# Altium project Trigger Mainboard.PrjPcb
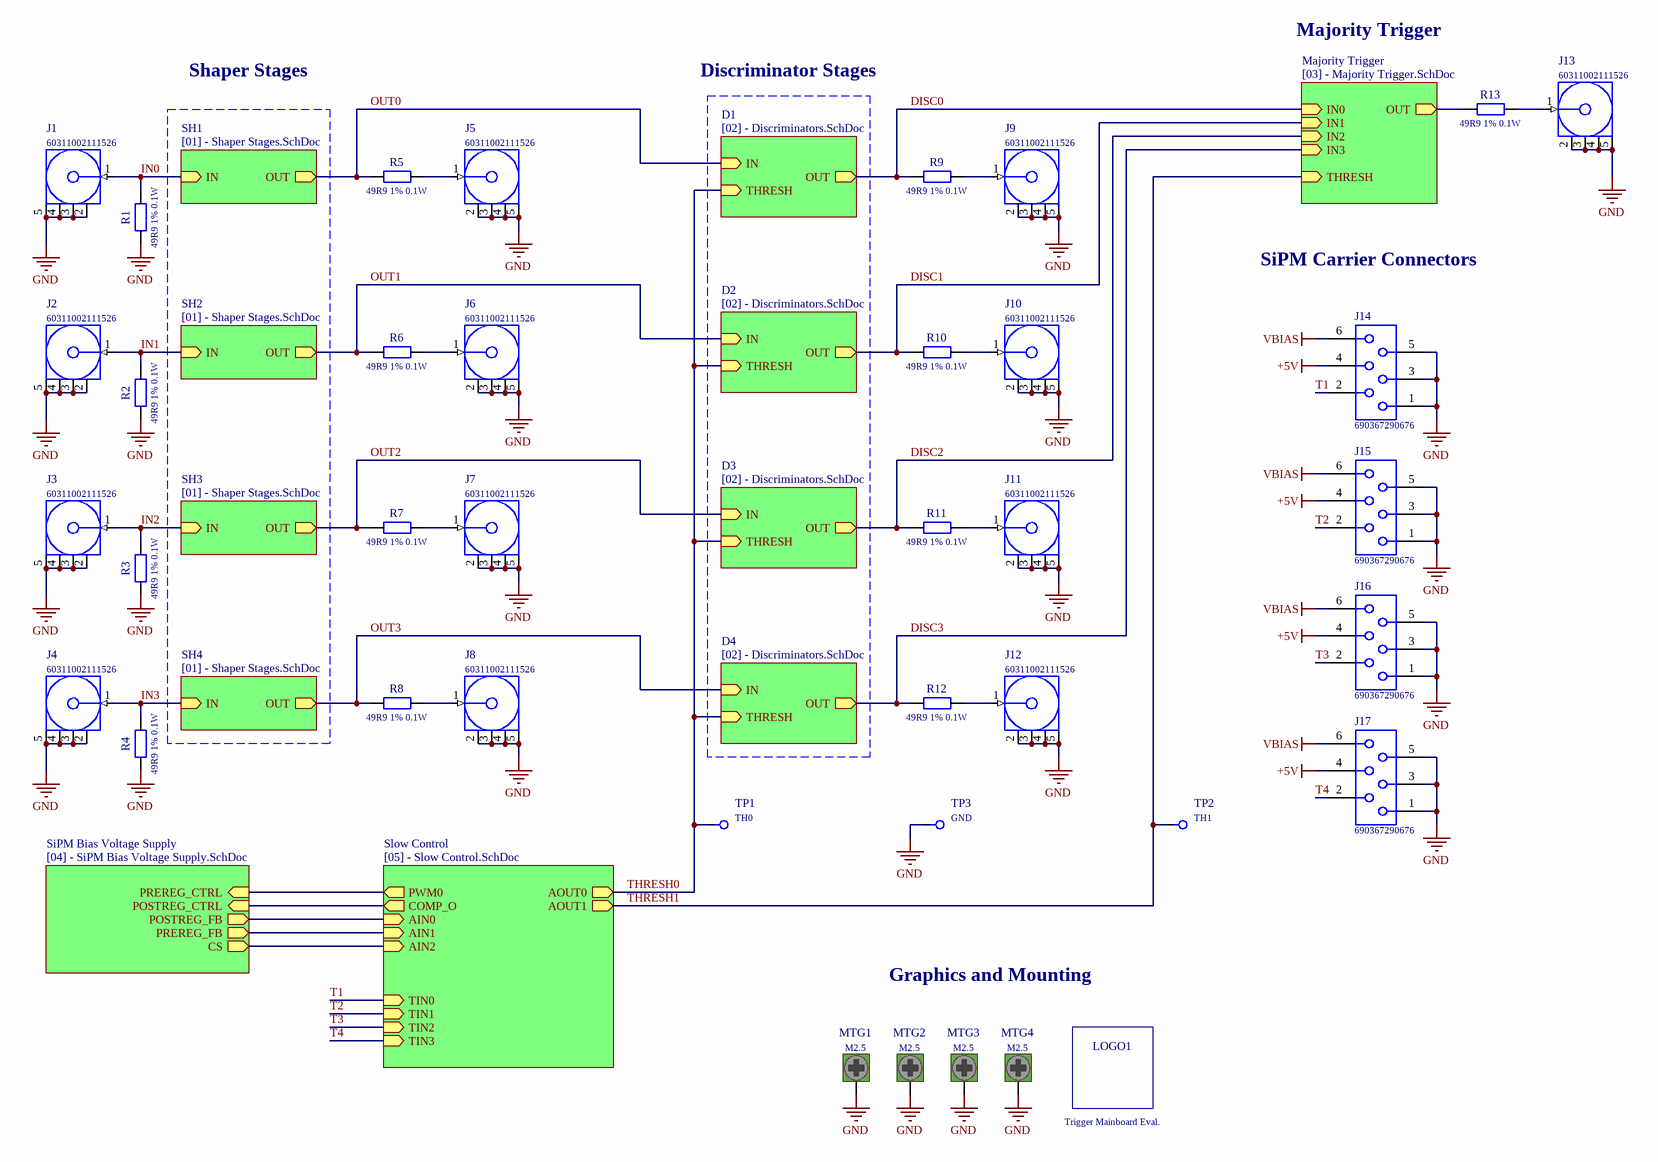
[diagram p0: [00] - Top Sheet.SchDoc]
My_Author: Name; My_Project_Heading: Title; My_Revision: 0
6 sheets, 252 parts. Net scope: hierarchical (ports join the sheet entries above them; power ports are global).
Board file: Trigger_Mainboard.PcbDoc
Sheets:
  [00] - Top Sheet.SchDoc
    Slow Control = [05] - Slow Control.SchDoc
    SH1 = [01] - Shaper Stages.SchDoc
    SH2 = [01] - Shaper Stages.SchDoc
    SH3 = [01] - Shaper Stages.SchDoc
    SH4 = [01] - Shaper Stages.SchDoc
    D1 = [02] - Discriminators.SchDoc
    Majority Trigger = [03] - Majority Trigger.SchDoc
    SiPM Bias Voltage Supply = [04] - SiPM Bias Voltage Supply.SchDoc
    D2 = [02] - Discriminators.SchDoc
    D3 = [02] - Discriminators.SchDoc
    D4 = [02] - Discriminators.SchDoc

## Sheet [00] - Top Sheet.SchDoc
size A3; Address1: III. Physikalisches Institut B; Address2: RWTH Aachen University; Address3: Otto-Blumenthal-Strasse; Address4: 52074 Aachen, GERMANY; DocumentNumber: 1; SheetNumber: 1; SheetTotal: 6

### Parts
J1  60311002111526  [60311002111526]
J2  60311002111526  [60311002111526]
J3  60311002111526  [60311002111526]
J4  60311002111526  [60311002111526]
J5  60311002111526  [60311002111526]
J6  60311002111526  [60311002111526]
J7  60311002111526  [60311002111526]
J8  60311002111526  [60311002111526]
J9  60311002111526  [60311002111526]
J10  60311002111526  [60311002111526]
J11  60311002111526  [60311002111526]
J12  60311002111526  [60311002111526]
J13  60311002111526  [60311002111526]
J14  690367290676  [690367290676]
J15  690367290676  [690367290676]
J16  690367290676  [690367290676]
J17  690367290676  [690367290676]
LOGO1  Trigger Mainboard Eval.  [RWTH_LOGO_4x15MM]  (no BOM)
MTG1  M2.5  [Mounting_Hole_M2.5]  (no BOM)
MTG2  M2.5  [Mounting_Hole_M2.5]  (no BOM)
MTG3  M2.5  [Mounting_Hole_M2.5]  (no BOM)
MTG4  M2.5  [Mounting_Hole_M2.5]  (no BOM)
R1  49R9 1% 0.1W  [0603_RES]
R2  49R9 1% 0.1W  [0603_RES]
R3  49R9 1% 0.1W  [0603_RES]
R4  49R9 1% 0.1W  [0603_RES]
R5  49R9 1% 0.1W  [0603_RES]
R6  49R9 1% 0.1W  [0603_RES]
R7  49R9 1% 0.1W  [0603_RES]
R8  49R9 1% 0.1W  [0603_RES]
R9  49R9 1% 0.1W  [0603_RES]
R10  49R9 1% 0.1W  [0603_RES]
R11  49R9 1% 0.1W  [0603_RES]
R12  49R9 1% 0.1W  [0603_RES]
R13  49R9 1% 0.1W  [0603_RES]
TP1  TH0  [Testpoint_5002]
TP2  TH1  [Testpoint_5002]
TP3  GND  [Testpoint_5001]

### Sub-sheets
D1 = [02] - Discriminators.SchDoc: IN (in), OUT (out), THRESH (in)
D2 = [02] - Discriminators.SchDoc: IN (in), OUT (out), THRESH (in)
D3 = [02] - Discriminators.SchDoc: IN (in), OUT (out), THRESH (in)
D4 = [02] - Discriminators.SchDoc: IN (in), OUT (out), THRESH (in)
Majority Trigger = [03] - Majority Trigger.SchDoc: IN0 (in), OUT (out), THRESH (in), IN2 (in), IN3 (in), IN1 (in)
SH1 = [01] - Shaper Stages.SchDoc: IN (in), OUT (out)
SH2 = [01] - Shaper Stages.SchDoc: IN (in), OUT (out)
SH3 = [01] - Shaper Stages.SchDoc: IN (in), OUT (out)
SH4 = [01] - Shaper Stages.SchDoc: IN (in), OUT (out)
SiPM Bias Voltage Supply = [04] - SiPM Bias Voltage Supply.SchDoc: PREREG_FB (out), CS (out), PREREG_CTRL (in), POSTREG_FB (out), POSTREG_CTRL (in)
Slow Control = [05] - Slow Control.SchDoc: TIN0 (in), TIN1 (in), TIN2 (in), TIN3 (in), PWM0 (out), AOUT0 (out), AOUT1 (out), AIN0 (in), AIN1 (in), COMP_O (out), AIN2 (in)

### Nets
+5V: J14.4 J15.4 J16.4 J17.4
GND: J1.2(GND) J1.3(GND) J1.4(GND) J1.5(GND) J2.2(GND) J2.3(GND) J2.4(GND) J2.5(GND) J3.2(GND) J3.3(GND) J3.4(GND) J3.5(GND) J4.2(GND) J4.3(GND) J4.4(GND) J4.5(GND) J5.2(GND) J5.3(GND) J5.4(GND) J5.5(GND) J6.2(GND) J6.3(GND) J6.4(GND) J6.5(GND) J7.2(GND) J7.3(GND) J7.4(GND) J7.5(GND) J8.2(GND) J8.3(GND) J8.4(GND) J8.5(GND) J9.2(GND) J9.3(GND) J9.4(GND) J9.5(GND) J10.2(GND) J10.3(GND) J10.4(GND) J10.5(GND) J11.2(GND) J11.3(GND) J11.4(GND) J11.5(GND) J12.2(GND) J12.3(GND) J12.4(GND) J12.5(GND) J13.2(GND) J13.3(GND) J13.4(GND) J13.5(GND) J14.1 J14.3 J14.5 J15.1 J15.3 J15.5 J16.1 J16.3 J16.5 J17.1 J17.3 J17.5 MTG1.1 MTG2.1 MTG3.1 MTG4.1 R1.2 R2.2 R3.2 R4.2 TP3.1
VBIAS: J14.6 J15.6 J16.6 J17.6
CSENSE: sheet Slow Control/AIN2, sheet SiPM Bias Voltage Supply/CS
DISC0: R9.2 ; sheet D1/OUT, sheet Majority Trigger/IN0
DISC1: R10.2 ; sheet Majority Trigger/IN1, sheet D2/OUT
DISC2: R11.2 ; sheet Majority Trigger/IN2, sheet D3/OUT
DISC3: R12.2 ; sheet Majority Trigger/IN3, sheet D4/OUT
IN0: J1.1(Signal) R1.1 ; sheet SH1/IN
IN1: J2.1(Signal) R2.1 ; sheet SH2/IN
IN2: J3.1(Signal) R3.1 ; sheet SH3/IN
IN3: J4.1(Signal) R4.1 ; sheet SH4/IN
OUT0: R5.2 ; sheet SH1/OUT, sheet D1/IN
OUT1: R6.2 ; sheet SH2/OUT, sheet D2/IN
OUT2: R7.2 ; sheet SH3/OUT, sheet D3/IN
OUT3: R8.2 ; sheet SH4/OUT, sheet D4/IN
POSTREG_CTRL: sheet Slow Control/COMP_O, sheet SiPM Bias Voltage Supply/POSTREG_CTRL
POSTREG_FB: sheet Slow Control/AIN1, sheet SiPM Bias Voltage Supply/PREREG_FB
PREREG_CTRL: sheet Slow Control/PWM0, sheet SiPM Bias Voltage Supply/PREREG_CTRL
PREREG_FB: sheet Slow Control/AIN0, sheet SiPM Bias Voltage Supply/POSTREG_FB
T1: J14.2 ; sheet Slow Control/TIN0
T2: J15.2 ; sheet Slow Control/TIN1
T3: J16.2 ; sheet Slow Control/TIN2
T4: J17.2 ; sheet Slow Control/TIN3
THRESH0: TP1.1 ; sheet Slow Control/AOUT0, sheet D1/THRESH, sheet D2/THRESH, sheet D3/THRESH, sheet D4/THRESH
THRESH1: TP2.1 ; sheet Slow Control/AOUT1, sheet Majority Trigger/THRESH
NetJ5_1: J5.1(Signal) R5.1
NetJ6_1: J6.1(Signal) R6.1
NetJ7_1: J7.1(Signal) R7.1
NetJ8_1: J8.1(Signal) R8.1
NetJ9_1: J9.1(Signal) R9.1
NetJ10_1: J10.1(Signal) R10.1
NetJ11_1: J11.1(Signal) R11.1
NetJ12_1: J12.1(Signal) R12.1
NetJ13_1: J13.1(Signal) R13.1
NetR13_2: R13.2 ; sheet Majority Trigger/OUT

### Notes on the sheet
- Majority Trigger
- Shaper Stages
- Discriminator Stages
- SiPM Carrier Connectors
- Graphics and Mounting
- TITLE
- REVISION
- PROJECT
- AUTHOR
- DESC.
- DATE
- SHEET
- OF

### Library data of the parts
J1-J13 = 60311002111526: WR-SMA PCB Jack, THT, Right Angle; Manufacturer: Wurth Elektronik; Impedance: 50Ohm; Frequency Range: DC~6GHz; Interface: MIL-STD-348; Center Contact Diameter: 1.27mm; ComponentLink1Description: Manufacturer; ComponentLink1URL: http://www.we-online.de; ComponentLink2Description: Datasheet; ComponentLink2URL: https://katalog.we-online.com/em/datasheet/60311002111526.pdf; PartNumber: 60311002111526; Published Date: May 2019; Operating Temperature: -65 to +165degC; Gender: Jack; Packaging: Tray; PackageReference: SMA; Mounting Technology: THT; Orientation Type: Right Angle
J14-J17 = 690367290676: WR-MM MiniModule Connector, Female, SMT, Vertical, pitch 2.54mm, 6pins; Manufacturer: Wurth Elektronik; Pin Number: 6; Insulation Resistance: >1000MOhm; Rated Current: 1.5A; Working Voltage: 100VAC; Withstanding Voltage: 500VAC; Contact Resistance: 10mOhm; ComponentLink1Description: Manufacturer; ComponentLink1URL: http://www.we-online.de; ComponentLink2Description: Datasheet; ComponentLink2URL: https://katalog.we-online.de/em/datasheet/690367290676.pdf; PartNumber: 690367290676; Published Date: June 2019; Pitch: 2.54mm; Operating Temperature: -40 to +105degC; Mounting Technology: SMT; Packaging: Tape and Reel; Gender: Female; Orientation: Vertical; PackageReference: WR-MM
LOGO1 = Logo: Logo Spaceholder.; Manufacturer: RWTH; Value: Trigger Mainboard Eval.
MTG1-MTG4 = Mounting_Hole: Simple mounting hole.; Value: M2.5
R1-R13 = Resistor: Simple generic resistor.; PackageReference: 0603; Value: 49R9 1% 0.1W
TP1-TP3 = Testpoint: Red PC Test Point, Miniature Phosphor Bronze, Silver Plating 0.040" (1.02mm) Hole Diameter Mounting Type.; Manufacturer: Keystone Electronics; PartNumber: 500X; PackageReference: Test Point
  TP1: Value: TH0
  TP2: Value: TH1
  TP3: Value: GND

## Sheet [05] - Slow Control.SchDoc
size A3; Address1: III. Physikalisches Institut B; Address2: RWTH Aachen University; Address3: Otto-Blumenthal-Strasse; Address4: 52074 Aachen, GERMANY; DocumentNumber: 6; SheetNumber: 6; SheetTotal: 6
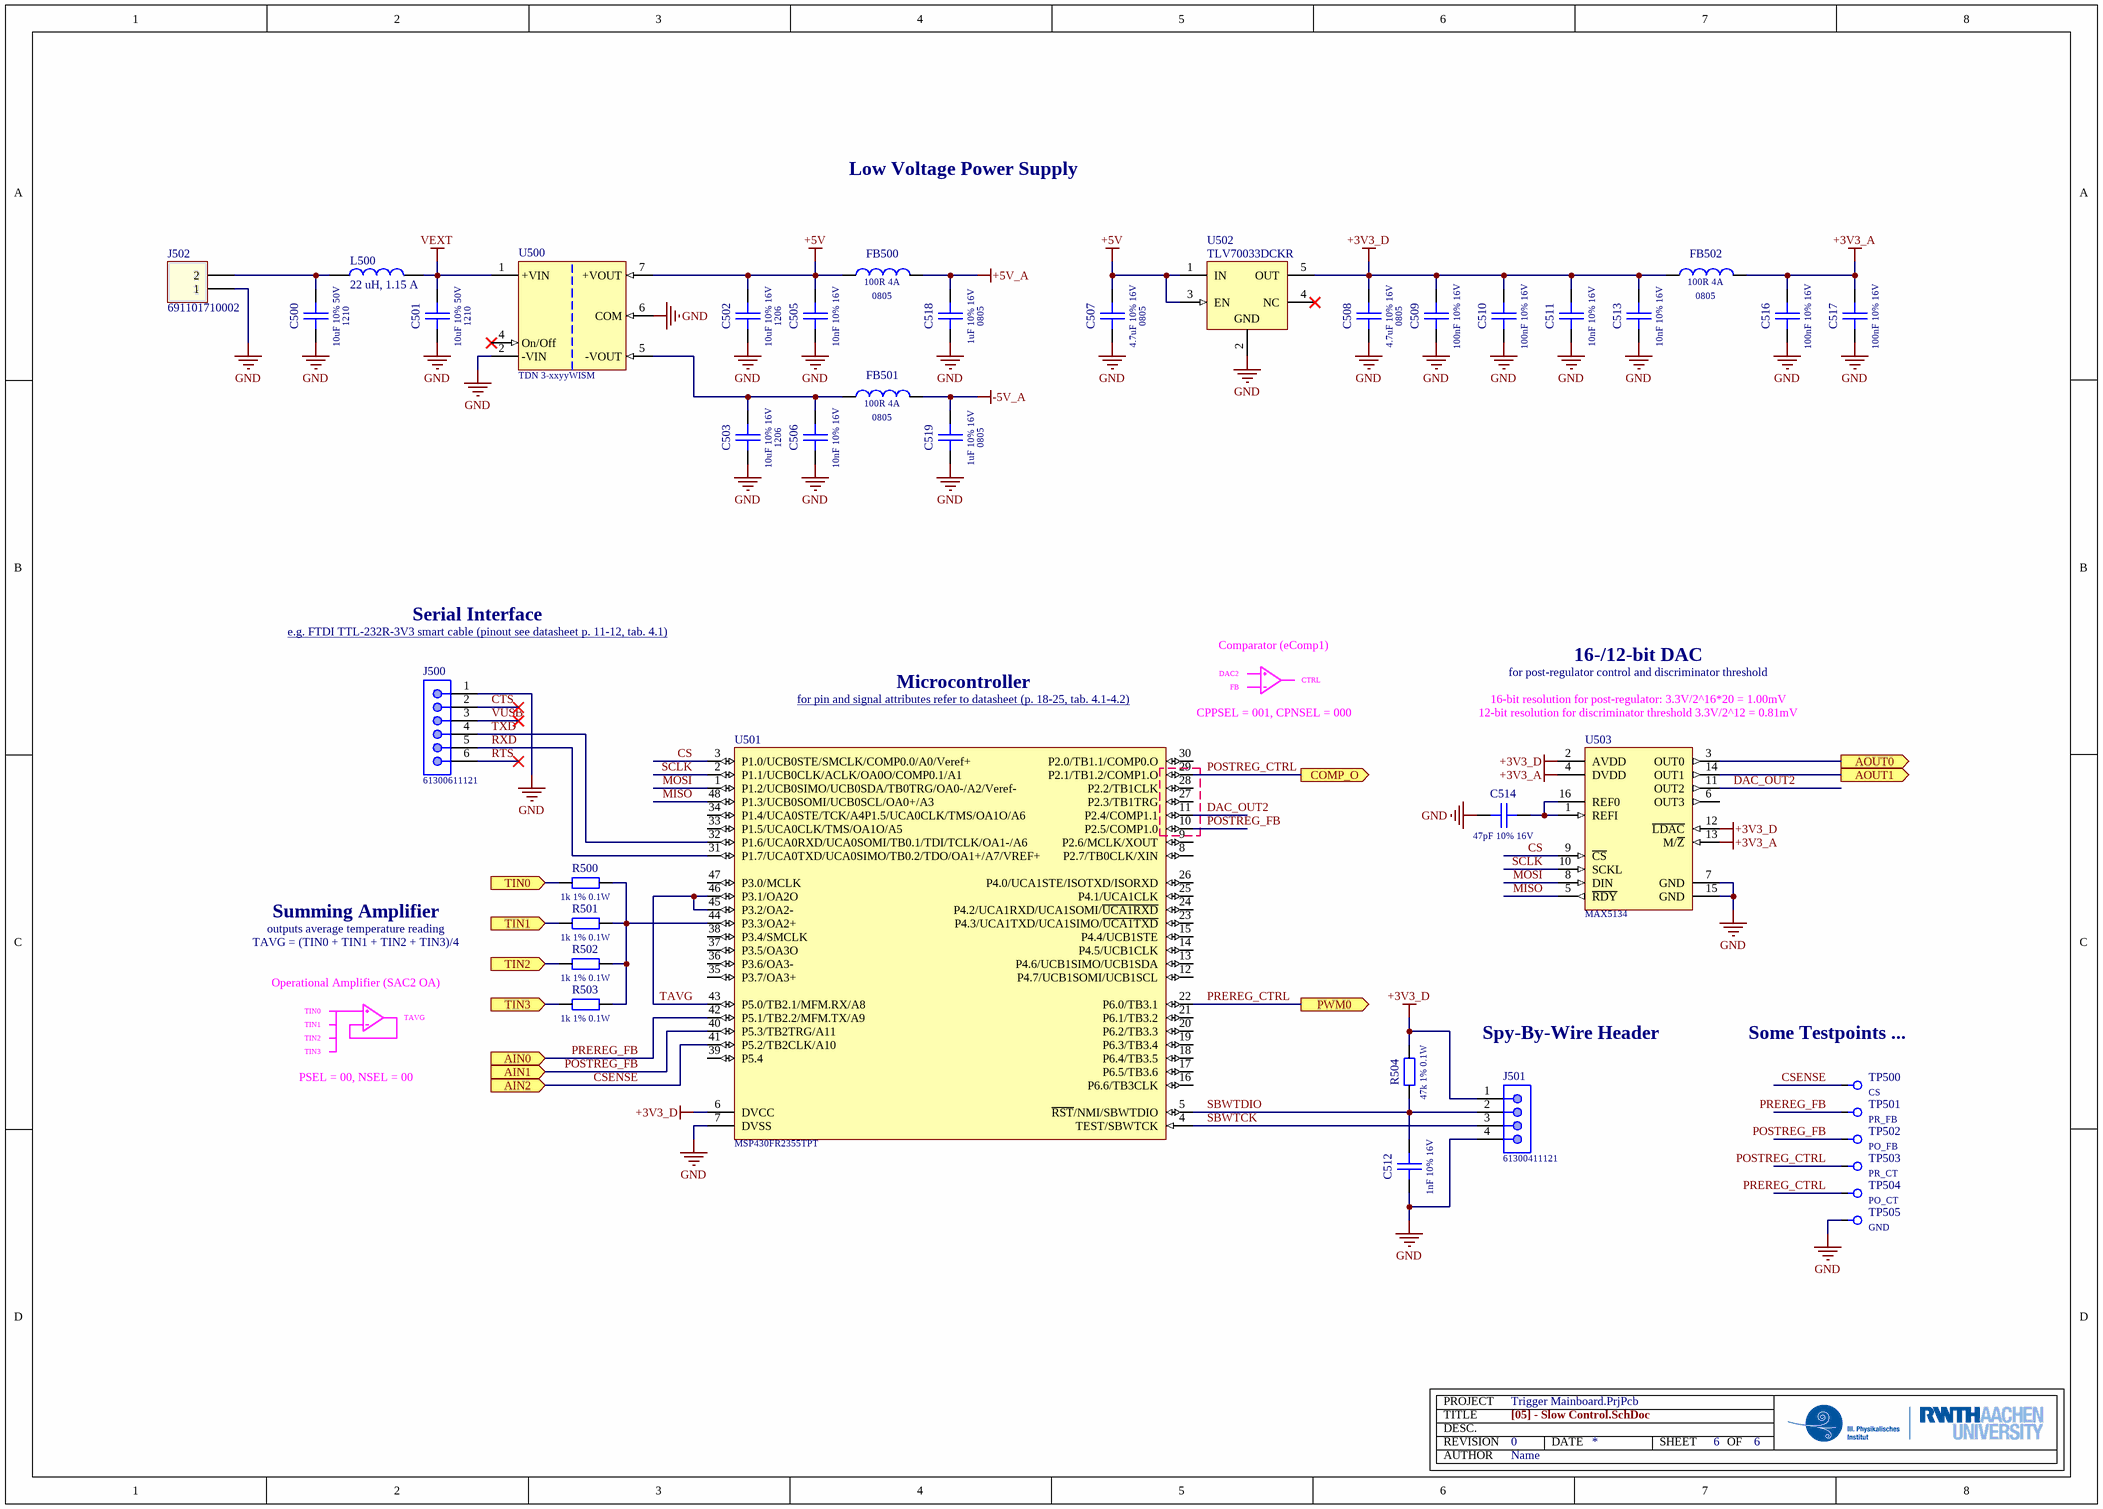
[diagram p1: [05] - Slow Control.SchDoc]

### Parts
C500  PackageReference: 1210  [1210_CAP]  (hidden comment: 10uF 10% 50V)
C501  PackageReference: 1210  [1210_CAP]  (hidden comment: 10uF 10% 50V)
C502  PackageReference: 1206  [1206_CAP]  (hidden comment: 10uF 10% 16V)
C503  PackageReference: 1206  [1206_CAP]  (hidden comment: 10uF 10% 16V)
C505  10nF 10% 16V  [0603_CAP]
C506  10nF 10% 16V  [0603_CAP]
C507  PackageReference: 0805  [0805_CAP]  (hidden comment: 4.7uF 10% 16V)
C508  PackageReference: 0805  [0805_CAP]  (hidden comment: 4.7uF 10% 16V)
C509  100nF 10% 16V  [0603_CAP]
C510  100nF 10% 16V  [0603_CAP]
C511  10nF 10% 16V  [0603_CAP]
C512  1nF 10% 16V  [0603_CAP]
C513  10nF 10% 16V  [0603_CAP]
C514  47pF 10% 16V  [0603_CAP]
C516  100nF 10% 16V  [0603_CAP]
C517  100nF 10% 16V  [0603_CAP]
C518  PackageReference: 0805  [0805_CAP]  (hidden comment: 1uF 10% 16V)
C519  PackageReference: 0805  [0805_CAP]  (hidden comment: 1uF 10% 16V)
FB500  PackageReference: 0805  [0805_RES]  (hidden comment: 100R 4A)
FB501  PackageReference: 0805  [0805_RES]  (hidden comment: 100R 4A)
FB502  PackageReference: 0805  [0603_RES]  (hidden comment: 100R 4A)
J500  61300611121  [61300611121]
J501  61300411121  [61300411121]
J502  691101710002  [691101710002]
L500  22 uH, 1.15 A  [WE-TPC_5828]
R500  1k 1% 0.1W  [0603_RES]
R501  1k 1% 0.1W  [0603_RES]
R502  1k 1% 0.1W  [0603_RES]
R503  1k 1% 0.1W  [0603_RES]
R504  47k 1% 0.1W  [0603_RES]
TP500  CS  [TESTPOINT_5019]
TP501  PR_FB  [TESTPOINT_5019]
TP502  PO_FB  [TESTPOINT_5019]
TP503  PR_CT  [TESTPOINT_5019]
TP504  PO_CT  [TESTPOINT_5019]
TP505  GND  [TESTPOINT_5019]
U500  TDN 3-xxyyWISM  [TDN_3WISM-PACK]
U501  MSP430FR2355TPT  [PQFP-48]
U502  TLV70033DCKR  [TI-DCK5_V]
U503  MAX5134  [TSSOP-16]

### Ports
AIN0 (in), AIN1 (in), AIN2 (in), AOUT0 (out), AOUT1 (out), COMP_O (out), PWM0 (out), TIN0 (in), TIN1 (in), TIN2 (in), TIN3 (in)

### Nets
+3V3_A: C516.2 C517.2 FB502.2 U503.4(DVDD) U503.13(M/~{Z})
+3V3_D: C508.2 C509.2 C510.2 C511.2 C513.2 FB502.1 J501.1 R504.1 U501.6(DVCC) U502.5(OUT) U503.2(AVDD) U503.12(~{LDAC})
+5V: C502.2 C505.2 C507.2 FB500.1 U500.7(+VOUT) U502.1(IN) U502.3(EN)
+5V_A: C518.2 FB500.2
-5V_A: C519.2 FB501.2
GND: C500.1 C501.1 C502.1 C503.1 C505.1 C506.1 C507.1 C508.1 C509.1 C510.1 C511.1 C512.1 C513.1 C514.1 C516.1 C517.1 C518.1 C519.1 J500.1 J501.4 J502.1 TP505.1 U500.2(-VIN) U500.6(COM) U501.7(DVSS) U502.2(GND) U503.7(GND) U503.15(GND)
VEXT: C501.2 L500.2 U500.1(+VIN)
~{CTS}: J500.2
CS: U501.3(P1.0/UCB0STE/SMCLK/COMP0.0/A0/Veref+) U503.9(~{CS})
CSENSE: TP500.1 U501.41(P5.2/TB2CLK/A10) ; port AIN2
DAC_OUT2: U501.11(P2.4/COMP1.1) U503.11(OUT2)
MISO: U501.48(P1.3/UCB0SOMI/UCB0SCL/OA0+/A3) U503.5(~{RDY})
MOSI: U501.1(P1.2/UCB0SIMO/UCB0SDA/TB0TRG/OA0-/A2/Veref-) U503.8(DIN)
POSTREG_CTRL: TP503.1 U501.29(P2.1/TB1.2/COMP1.O) ; port COMP_O
POSTREG_FB: TP502.1 U501.10(P2.5/COMP1.0) U501.40(P5.3/TB2TRG/A11) ; port AIN1
PREREG_CTRL: TP504.1 U501.22(P6.0/TB3.1) ; port PWM0
PREREG_FB: TP501.1 U501.42(P5.1/TB2.2/MFM.TX/A9) ; port AIN0
~{RTS}: J500.6
RXD: J500.5 U501.31(P1.7/UCA0TXD/UCA0SIMO/TB0.2/TDO/OA1+/A7/VREF+)
SBWTCK: J501.3 U501.4(TEST/SBWTCK)
SBWTDIO: C512.2 J501.2 R504.2 U501.5(~{RST}/NMI/SBWTDIO)
SCLK: U501.2(P1.1/UCB0CLK/ACLK/OA0O/COMP0.1/A1) U503.10(SCKL)
T1: R500.2 ; port TIN0
T2: R501.2 ; port TIN1
T3: R502.2 ; port TIN2
T4: R503.2 ; port TIN3
TAVG: U501.43(P5.0/TB2.1/MFM.RX/A8) U501.45(P3.2/OA2-) U501.46(P3.1/OA2O)
THRESH0: U503.3(OUT0) ; port AOUT0
THRESH1: U503.14(OUT1) ; port AOUT1
TXD: J500.4 U501.32(P1.6/UCA0RXD/UCA0SOMI/TB0.1/TDI/TCLK/OA1-/A6)
VUSB: J500.3
NetC500_2: C500.2 J502.2 L500.1
NetC503_2: C503.2 C506.2 FB501.1 U500.5(-VOUT)
NetC514_2: C514.2 U503.1(REFI) U503.16(REF0)
NetR500_1: R500.1 R501.1 R502.1 R503.1 U501.44(P3.3/OA2+)

Not connected (* = marked no-connect by the designer): U500 4(On/Off)*; U501 8(P2.7/TB0CLK/XIN) 9(P2.6/MCLK/XOUT) 12(P4.7/UCB1SOMI/UCB1SCL) 13(P4.6/UCB1SIMO/UCB1SDA) 14(P4.5/UCB1CLK) 15(P4.4/UCB1STE) 16(P6.6/TB3CLK) 17(P6.5/TB3.6) 18(P6.4/TB3.5) 19(P6.3/TB3.4) 20(P6.2/TB3.3) 21(P6.1/TB3.2) 23(P4.3/UCA1TXD/UCA1SIMO/~{UCA1TXD}) 24(P4.2/UCA1RXD/UCA1SOMI/~{UCA1RXD}) 25(P4.1/UCA1CLK) 26(P4.0/UCA1STE/ISOTXD/ISORXD) 27(P2.3/TB1TRG) 28(P2.2/TB1CLK) 30(P2.0/TB1.1/COMP0.O) 33(P1.5/UCA0CLK/TMS/OA1O/A5) 34(P1.4/UCA0STE/TCK/A4P1.5/UCA0CLK/TMS/OA1O/A6) 35(P3.7/OA3+) 36(P3.6/OA3-) 37(P3.5/OA3O) 38(P3.4/SMCLK) 39(P5.4) 47(P3.0/MCLK); U502 4(NC)*; U503 6(OUT3)

### Notes on the sheet
- Low Voltage Power Supply
- Serial Interface
- e.g. FTDI TTL-232R-3V3 smart cable (pinout see datasheet p. 11-12, tab. 4.1) <https://www.ftdichip.com/Support/Documents/DataSheets/Cables/DS_TTL-232R_CABLES.pdf>
- Comparator (eComp1)
- Microcontroller
- for pin and signal attributes refer to datasheet (p. 18-25, tab. 4.1-4.2) <https://www.ti.com/lit/ds/symlink/msp430fr2355.pdf?ts=1593776383476&ref_url=https%253A%252F%252Fwww.ti.com%252Fproduct%252FMSP430FR2355>
- DAC2
- FB
- (near U501) CPPSEL = 001, CPNSEL = 000
- CTRL
- 16-/12-bit DAC
- for post-regulator control and discriminator threshold
- 16-bit resolution for post-regulator: 3.3V/2^16*20 = 1.00mV
- (near U503) 12-bit resolution for discriminator threshold 3.3V/2^12 = 0.81mV
- Summing Amplifier
- outputs average temperature reading
- TAVG = (TIN0 + TIN1 + TIN2 + TIN3)/4
- Operational Amplifier (SAC2 OA)
- TIN0
- TIN1
- TIN2
- TIN3
- TAVG
- Spy-By-Wire Header
- (near TP500) Some Testpoints ...
- PSEL = 00, NSEL = 00
- TITLE
- REVISION
- PROJECT
- AUTHOR
- DESC.
- DATE
- SHEET
- OF

### Library data of the parts
C500-C503 C505-C514 C516-C519 = Capacitor: Simple generic capacitor.
  C500 C501: Value: 10uF 10% 50V
  C502 C503: Value: 10uF 10% 16V
  C505 C506 C511 C513: PackageReference: 0603; Value: 10nF 10% 16V
  C507 C508: Value: 4.7uF 10% 16V
  C509 C510 C516 C517: PackageReference: 0603; Value: 100nF 10% 16V
  C512: PackageReference: 0603; Value: 1nF 10% 16V
  C514: PackageReference: 0603; Value: 47pF 10% 16V
  C518 C519: Value: 1uF 10% 16V
FB500-FB502 = Inductor: Simple generic inductor.; Manufacturer: TDK; PartNumber: MPZ2012S101ATD25; Value: 100R 4A
J500 = 61300611121: WR-PHD Pin Header, THT, pitch 2.54mm, Single Row, Vertical, 6pin; Pin Number: 6; Gender: Male; Rated Current: 3A; Working Voltage: 250VAC; Withstanding Voltage: 500VAC; Contact Resistance: 20mOhm; ComponentLink1Description: Manufacturer; ComponentLink1URL: http://www.we-online.de; ComponentLink2Description: Datasheet; ComponentLink2URL: https://katalog.we-online.de/em/datasheet/6130xx11121.pdf; Part Number: 61300611121; Published Date: June 2019; Publisher: Wurth Elektronik; Pitch: 2.54mm; Operating Temperature: -40 to +105degC; Mounting Technology: THT; Packaging: Bag; Row Number: Single; Orientation: Vertical
J501 = 61300411121: WR-PHD Pin Header, THT, pitch 2.54mm, Single Row, Vertical, 4pin; Pin Number: 4; Gender: Male; Rated Current: 3A; Working Voltage: 250VAC; Withstanding Voltage: 500VAC; Contact Resistance: 20mOhm; ComponentLink1Description: Manufacturer; ComponentLink1URL: http://www.we-online.de; ComponentLink2Description: Datasheet; ComponentLink2URL: https://katalog.we-online.de/em/datasheet/6130xx11121.pdf; Part Number: 61300411121; Published Date: June 2019; Publisher: Wurth Elektronik; Pitch: 2.54mm; Operating Temperature: -40 to +105degC; Mounting Technology: THT; Packaging: Bag; Row Number: Single; Orientation: Vertical
J502 = 691101710002: WR-TBL Serie 101 - 5.00 mm Horizontal Entry Modular, 02p; Pitch: 5 mm; ComponentLink1Description: Manufacturer; ComponentLink1URL: http://www.we-online.de; ComponentLink2Description: Datasheet; ComponentLink2URL: http://katalog.we-online.de/em/datasheet/6911017100xx.pdf; Part Number: 691101710002; Published Date: Feb. 2017; Publisher: Wurth Elektronik; Pin Number: 02p
L500 = 744053220: SMT Shielded Tiny Power Inductor WE-TPC, size 5828, 22 uH, 1.15 A; Rated Current: 1.15 A; Inductance: 22 uH; DC Resistance max.: 120 mOhm; Self Resonant Frequency: 20 MHz; Saturation Current: 0.9 A; ComponentLink1Description: Manufacturer; ComponentLink1URL: http://www.we-online.de; ComponentLink2Description: Datasheet; ComponentLink2URL: https://katalog.we-online.com/pbs/datasheet/744053220.pdf; Part Number: 744053220; Published Date: December 2018; Publisher: Wurth Elektronik; PackageReference: 5828; Operating Temperature: -40 to +125 degC; Mounting Technology: SMT; Packaging: Tape and Reel
R500-R504 = Resistor: Simple generic resistor.; PackageReference: 0603
  R500-R503: Value: 1k 1% 0.1W
  R504: Value: 47k 1% 0.1W
TP500-TP505 = Testpoint: as TP1 on sheet [00] - Top Sheet; PackageReference: Test Point
  TP500: Value: CS
  TP501: Value: PR_FB
  TP502: Value: PO_FB
  TP503: Value: PR_CT
  TP504: Value: PO_CT
  TP505: Value: GND
U500 = _BLANK_1: TDN 3WISM Series, 3 Watt DC/DC converter.; Manufacturer: Traco Power; PackageReference: TDN-3-Pack; Value: TDN 3-xxyyWISM
U501 = MSP430FR2355TPT: Mixed-Signal Microcontroller.; Manufacturer: Texas Instruments; PackageReference: LQFP-48; PartNumber: MSP430FR2355TPT; Supplier1: Mouser; Supplier1Link: https://www.mouser.de/ProductDetail/Texas-Instruments/MSP430FR2355TPT?qs=sGAEpiMZZMsp%252Bcahb6g%252BW1GHiEy7RoiAFs9DV1sKylCWNRvNatvbuQ%3D%3D; Supplier1PartNumber: 595-MSP430FR2355TPT; Value: MSP430FR2355TPT
U502 = TLV70033DCKR: Single Output LDO, 200 mA, Fixed 3.3 V Output, 2 to 5.5 V Input, with Low IQ, 5-pin SC70 (DCK), -40 to 125 degC, Green (RoHS & no Sb/Br); Manufacturer: Texas Instruments; Accuracy(%): 2; Fixed Output Options(V): 3.3; Iout(Max)(A): 0.2; Iq(Typ)(mA): 0.03; SubFamily: Single Channel LDO; Vdo(Typ)(mV): 175; Vin(Max)(V): 5.5; DatasheetVersion: SLVSA00D; PackageVersion: 4093553-3/G; PackageReference: DCK5; PackageDescription: 5-Pin Plastic Small-Outline, Body 2 x 1.25 mm, Pitch 0.65 mm; Supplier 1: Digi-Key; Supplier Part Number 1: 296-32413-2-ND; Supplier 2: Digi-Key; Supplier Part Number 2: 296-32413-1-ND; Supplier 3: Digi-Key; Supplier Part Number 3: 296-32413-6-ND; Supplier 4: Newark; Supplier Part Number 4: 55R7467; Supplier 5: Mouser; Supplier Part Number 5: 595-TLV70033DCKR; Eco-Plan: Green (RoHS & no Sb/Br); Vin(Min)(V): 2; Vout Adj(Max)(V): 3.3; Vout Adj(Min)(V): 3.3; Mounting Technology: Surface Mount; Code_JEDEC: MO-203; PartNumber: TLV70033DCKR; ComponentLink1Description: Manufacturer URL; ComponentLink1URL: http://www.ti.com/; ComponentLink2Description: Datasheet; ComponentLink2URL: http://www.ti.com/general/docs/lit/getliterature.tsp?genericPartNumber=TLV70033&fileType=pdf; ComponentLink3Description: Package Specification; ComponentLink3URL: http://www.ti.com/litv/pdf/mpds025f
U503 = MAX5134: Pin-/Software-Compatible, 16-/12-Bit, Voltage-Output DACs.; Manufacturer: Maxim Integrated; PartNumber: MAX5134AGUE+; PackageReference: TSSOP-16; Supplier1: RS-Components; Supplier1PartNumber: 190-5093; Supplier1Link: https://de.rs-online.com/web/p/d-a-wandler/1905093/; ComponentLink1Description: New link; ComponentLink1URL: *; Value: MAX5134

## Sheet [01] - Shaper Stages.SchDoc
size A4; Address1: III. Physikalisches Institut B; Address2: RWTH Aachen University; Address3: Otto-Blumenthal-Strasse; Address4: 52074 Aachen, GERMANY; DocumentNumber: 2; SheetNumber: 2; SheetTotal: 6
Used 4 times, as channels SH1, SH2, SH3, SH4. Parts and nets are listed once, with the designators drawn on the sheet.
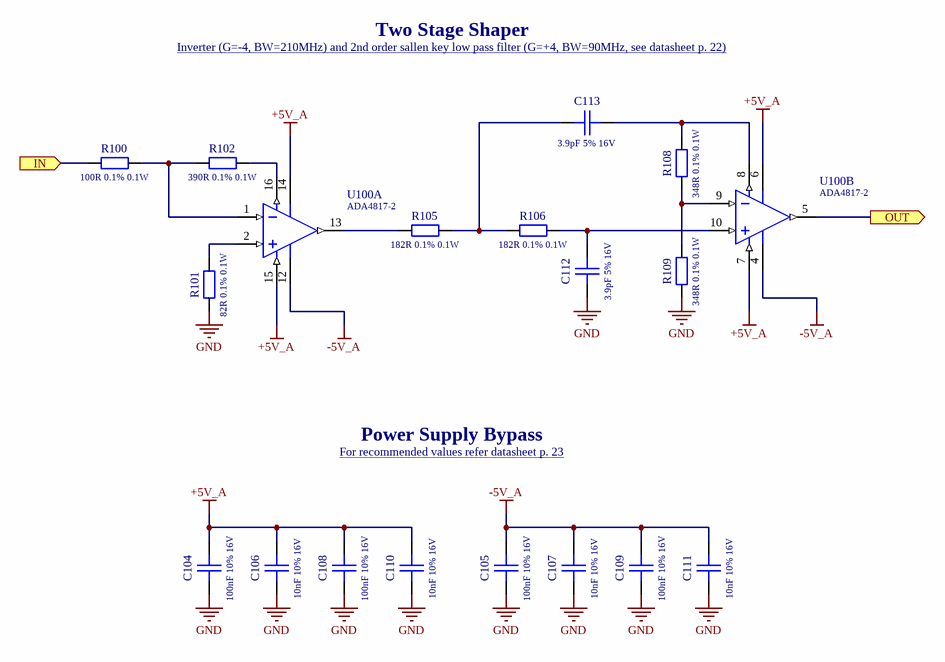
[diagram p2: [01] - Shaper Stages.SchDoc]

### Parts
C104  100nF 10% 16V  [0603_CAP]
C105  100nF 10% 16V  [0603_CAP]
C106  10nF 10% 16V  [0603_CAP]
C107  10nF 10% 16V  [0603_CAP]
C108  100nF 10% 16V  [0603_CAP]
C109  100nF 10% 16V  [0603_CAP]
C110  10nF 10% 16V  [0603_CAP]
C111  10nF 10% 16V  [0603_CAP]
C112  3.9pF 5% 16V  [0603_CAP]
C113  3.9pF 5% 16V  [0603_CAP]
R100  100R 0.1% 0.1W  [0603_RES]
R101  82R 0.1% 0.1W  [0603_RES]
R102  390R 0.1% 0.1W  [0603_RES]
R105  182R 0.1% 0.1W  [0603_RES]
R106  182R 0.1% 0.1W  [0603_RES]
R108  348R 0.1% 0.1W  [0603_RES]
R109  348R 0.1% 0.1W  [0603_RES]
U100  ADA4817-2  [LFCSP-16]  (parts A,B of 2)

### Ports
IN (in), OUT (out)

### Nets
+5V_A: C104.2 C106.2 C108.2 C110.2 U100.6(#VS2) U100.7(~{PD2}) U100.14(VS+) U100.15(~{PD})
-5V_A: C105.2 C107.2 C109.2 C111.2 U100.4(-VS2) U100.12(-VS1)
GND: C104.1 C105.1 C106.1 C107.1 C108.1 C109.1 C110.1 C111.1 C112.1 R101.2 R109.2
IN: R100.2 ; port IN
OUT: U100.5(OUT2) ; port OUT
NetC112_2: C112.2 R106.1 U100.10(IN2+)
NetC113_1: C113.1 R105.1 R106.2
NetC113_2: C113.2 R108.1 U100.8(FB2)
NetR100_1: R100.1 R102.2 U100.1(IN1-)
NetR101_1: R101.1 U100.2(IN2+)
NetR102_1: R102.1 U100.16(FB1)
NetR105_2: R105.2 U100.13(OUT1)
NetR108_2: R108.2 R109.1 U100.9(IN2-)

### Channels
SH1: designators end in A; ports IN=IN0 OUT=OUT0
SH2: designators end in B; ports IN=IN1 OUT=OUT1
SH3: designators end in C; ports IN=IN2 OUT=OUT2
SH4: designators end in D; ports IN=IN3 OUT=OUT3

### Notes on the sheet
- Two Stage Shaper
- Inverter (G=-4, BW=210MHz) and 2nd order sallen key low pass filter (G=+4, BW=90MHz, see datasheet p. 22) <https://www.analog.com/media/en/technical-documentation/data-sheets/ADA4817-1_4817-2.pdf>
- Power Supply Bypass
- For recommended values refer datasheet p. 23 <https://www.analog.com/media/en/technical-documentation/data-sheets/ADA4817-1_4817-2.pdf>
- TITLE
- REVISION
- PROJECT
- AUTHOR
- DESC.
- DATE
- SHEET
- OF

### Library data of the parts
C104-C113 = Capacitor: Simple generic capacitor.; PackageReference: 0603
  C104 C105 C108 C109: Value: 100nF 10% 16V
  C106 C107 C110 C111: Value: 10nF 10% 16V
  C112 C113: Value: 3.9pF 5% 16V
R100-R102 R105 R106 R108 R109 = Resistor: Simple generic resistor.; PackageReference: 0603
  R100: Value: 100R 0.1% 0.1W
  R101: Value: 82R 0.1% 0.1W
  R102: Value: 390R 0.1% 0.1W
  R105 R106: Value: 182R 0.1% 0.1W
  R108 R109: Value: 348R 0.1% 0.1W
U100 = ADA4817-2: Low Noise, 1 GHz FastFET Op Amps; Manufacturer: Analog Devices; PartNumber: LMV358QDGKR; PackageReference: LFCSP-16; Supplier1: RS-Components; Supplier1PartNumber: 764-8781; Supplier1Link: https://de.rs-online.com/web/p/operationsverstarker/7648781/; Value: ADA4817-2

## Sheet [02] - Discriminators.SchDoc
size A4; Address1: III. Physikalisches Institut B; Address2: RWTH Aachen University; Address3: Otto-Blumenthal-Strasse; Address4: 52074 Aachen, GERMANY; DocumentNumber: 3; SheetNumber: 3; SheetTotal: 6
Used 4 times, as channels D1, D2, D3, D4. Parts and nets are listed once, with the designators drawn on the sheet.
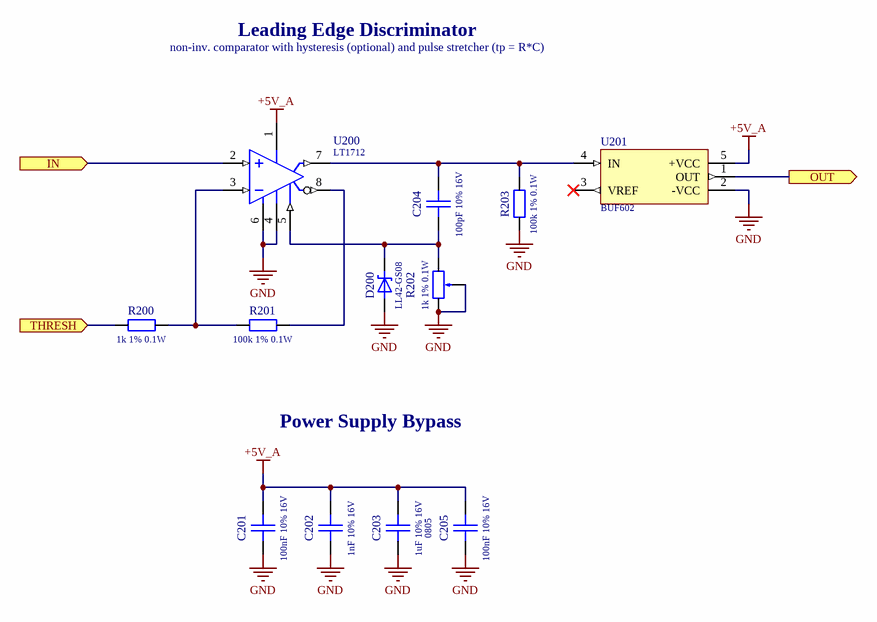
[diagram p3: [02] - Discriminators.SchDoc]

### Parts
C201  100nF 10% 16V  [0603_CAP]
C202  1nF 10% 16V  [0603_CAP]
C203  PackageReference: 0805  [0805_CAP]  (hidden comment: 1uF 10% 16V)
C204  100pF 10% 16V  [0603_CAP]
C205  100nF 10% 16V  [0603_CAP]
D200  LL42-GS08  [MiniMELF]
R200  1k 1% 0.1W  [0603_RES]
R201  100k 1% 0.1W  [0603_RES]
R202  1k 1% 0.1W  [3224W]
R203  100k 1% 0.1W  [0603_RES]
U200  LT1712  [MSOP-8]
U201  BUF602  [SOT-23-5]

### Ports
IN (in), OUT (out), THRESH (in)

### Nets
+5V_A: C201.2 C202.2 C203.2 C205.2 U200.1(+V) U201.5(+VCC)
GND: C201.1 C202.1 C203.1 C205.1 D200.2(A) R202.1(CCW) R202.2(WIPER) R203.2 U200.4(-V) U200.6(GND) U201.2(-VCC)
IN: U200.2(+IN) ; port IN
OUT: U201.1(OUT) ; port OUT
THRESH: R200.2 ; port THRESH
NetC204_1: C204.1 D200.1(K) R202.3(CW) U200.5(LE)
NetC204_2: C204.2 R203.1 U200.7(Q) U201.4(IN)
NetR200_1: R200.1 R201.2 U200.3(-IN)
NetR201_1: R201.1 U200.8(~{Q})

Not connected (* = marked no-connect by the designer): U201 3(VREF)*

### Channels
D1: designators end in A; ports IN=OUT0 OUT=DISC0 THRESH=THRESH0
D2: designators end in B; ports IN=OUT1 OUT=DISC1 THRESH=THRESH0
D3: designators end in C; ports IN=OUT2 OUT=DISC2 THRESH=THRESH0
D4: designators end in D; ports IN=OUT3 OUT=DISC3 THRESH=THRESH0

### Notes on the sheet
- Leading Edge Discriminator
- non-inv. comparator with hysteresis (optional) and pulse stretcher (tp = R*C)
- Power Supply Bypass
- TITLE
- REVISION
- PROJECT
- AUTHOR
- DESC.
- DATE
- SHEET
- OF

### Library data of the parts
C201-C205 = Capacitor: Simple generic capacitor.
  C201 C205: PackageReference: 0603; Value: 100nF 10% 16V
  C202: PackageReference: 0603; Value: 1nF 10% 16V
  C203: Value: 1uF 10% 16V
  C204: PackageReference: 0603; Value: 100pF 10% 16V
D200 = Schottky Diode: Simple schottky diode.; Manufacturer: Vishay; PackageReference: MiniMELF; PartNumber: LL42-GS08; Value: LL42-GS08
R200 R201 R203 = Resistor: Simple generic resistor.; PackageReference: 0603
  R200: Value: 1k 1% 0.1W
  R201 R203: Value: 100k 1% 0.1W
R202 = Potentiometer: Simple generic potentiometer.; Value: 1k 1% 0.1W
U200 = LT1712: Single/Dual 4.5ns, 3V/5V/±5V, Rail-to-Rail Comparators; Manufacturer: Analog Devices; PartNumber: LT1712CGN; PackageReference: SSOP-16; Supplier1: Digi-Key; Supplier1PartNumber: LT1712CGN#PBF-ND; Supplier1Link: https://www.digikey.de/product-detail/de/linear-technology-analog-devices/LT1712CGN-PBF/LT1712CGN-PBF-ND/961051; Value: LT1712
U201 = BUF602: High-Speed, Closed-Loop Buffer.; Manufacturer: Texas Instruments; PartNumber: BUF602IDBVT; PackageReference: SOT-23-5; Value: BUF602

## Sheet [03] - Majority Trigger.SchDoc
size A4; Address1: III. Physikalisches Institut B; Address2: RWTH Aachen University; Address3: Otto-Blumenthal-Strasse; Address4: 52074 Aachen, GERMANY; DocumentNumber: 4; SheetNumber: 4; SheetTotal: 6
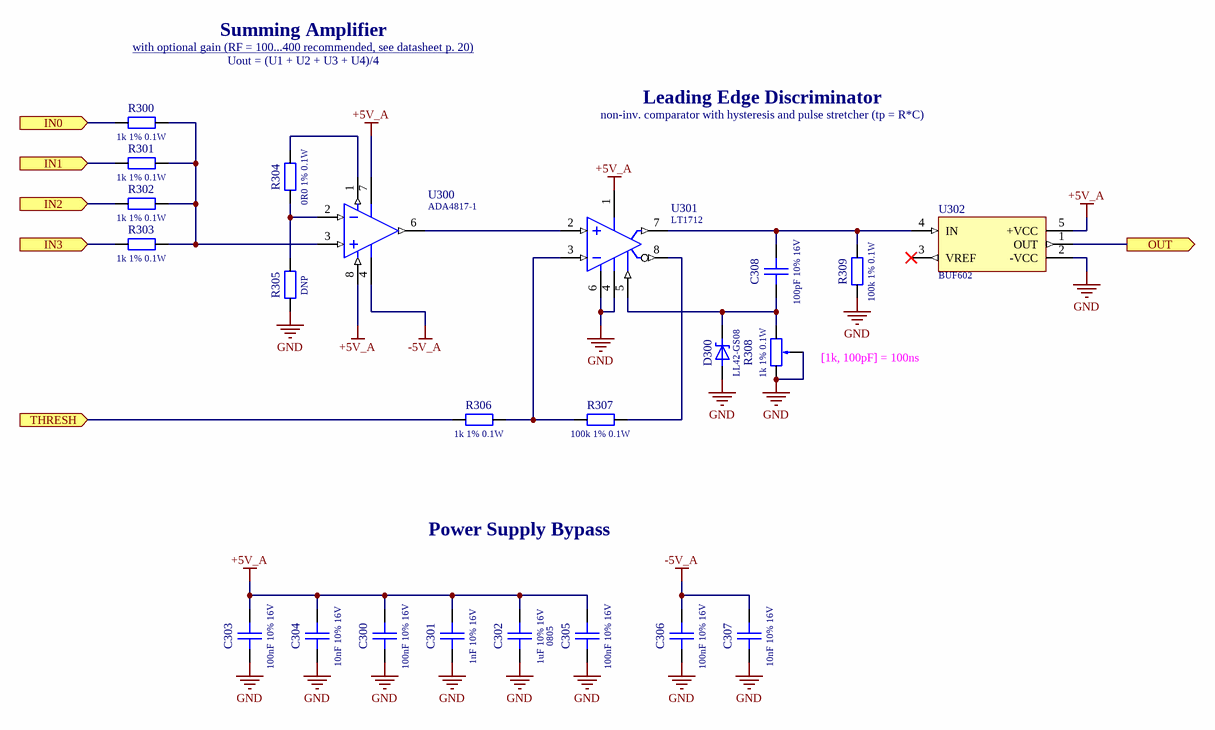
[diagram p4: [03] - Majority Trigger.SchDoc]

### Parts
C300  100nF 10% 16V  [0603_CAP]
C301  1nF 10% 16V  [0603_CAP]
C302  PackageReference: 0805  [0805_CAP]  (hidden comment: 1uF 10% 16V)
C303  100nF 10% 16V  [0603_CAP]
C304  10nF 10% 16V  [0603_CAP]
C305  100nF 10% 16V  [0603_CAP]
C306  100nF 10% 16V  [0603_CAP]
C307  10nF 10% 16V  [0603_CAP]
C308  100pF 10% 16V  [0603_CAP]
D300  LL42-GS08  [MiniMELF]
R300  1k 1% 0.1W  [0603_RES]
R301  1k 1% 0.1W  [0603_RES]
R302  1k 1% 0.1W  [0603_RES]
R303  1k 1% 0.1W  [0603_RES]
R304  0R0 1% 0.1W  [0603_RES]
R305  DNP  [0603_RES]
R306  1k 1% 0.1W  [0603_RES]
R307  100k 1% 0.1W  [0603_RES]
R308  1k 1% 0.1W  [3224W]
R309  100k 1% 0.1W  [0603_RES]
U300  ADA4817-1  [SOIC_8]
U301  LT1712  [MSOP-8]
U302  BUF602  [SOT-23-5]

### Ports
IN0 (in), IN1 (in), IN2 (in), IN3 (in), OUT (out), THRESH (in)

### Nets
+5V_A: C300.2 C301.2 C302.2 C303.2 C304.2 C305.2 U300.7(+VS) U300.8(~{PD}) U301.1(+V) U302.5(+VCC)
-5V_A: C306.2 C307.2 U300.4(-VS)
GND: C300.1 C301.1 C302.1 C303.1 C304.1 C305.1 C306.1 C307.1 D300.2(A) R305.2 R308.1(CCW) R308.2(WIPER) R309.2 U301.4(-V) U301.6(GND) U302.2(-VCC)
DISC0: R300.2 ; port IN0
DISC1: R301.2 ; port IN1
DISC2: R302.2 ; port IN2
DISC3: R303.2 ; port IN3
THRESH1: R306.2 ; port THRESH
NetC308_1: C308.1 D300.1(K) R308.3(CW) U301.5(LE)
NetC308_2: C308.2 R309.1 U301.7(Q) U302.4(IN)
NetR13_2: U302.1(OUT) ; port OUT
NetR300_1: R300.1 R301.1 R302.1 R303.1 U300.3(IN+)
NetR304_1: R304.1 U300.1(FB)
NetR304_2: R304.2 R305.1 U300.2(IN-)
NetR306_1: R306.1 R307.2 U301.3(-IN)
NetR307_1: R307.1 U301.8(~{Q})
NetU300_6: U300.6(OUT) U301.2(+IN)

Not connected (* = marked no-connect by the designer): U302 3(VREF)*

### Notes on the sheet
- Summing Amplifier
- with optional gain (RF = 100...400 recommended, see datasheet p. 20) <https://www.analog.com/media/en/technical-documentation/data-sheets/ADA4817-1_4817-2.pdf>
- Uout = (U1 + U2 + U3 + U4)/4
- Leading Edge Discriminator
- non-inv. comparator with hysteresis and pulse stretcher (tp = R*C)
- (near R308) [1k, 100pF] = 100ns
- Power Supply Bypass
- TITLE
- REVISION
- PROJECT
- AUTHOR
- DESC.
- DATE
- SHEET
- OF

### Library data of the parts
C300-C308 = Capacitor: Simple generic capacitor.
  C300 C303 C305 C306: PackageReference: 0603; Value: 100nF 10% 16V
  C301: PackageReference: 0603; Value: 1nF 10% 16V
  C302: Value: 1uF 10% 16V
  C304 C307: PackageReference: 0603; Value: 10nF 10% 16V
  C308: PackageReference: 0603; Value: 100pF 10% 16V
D300 = Schottky Diode: as D200 on sheet [02] - Discriminators; PackageReference: MiniMELF; PartNumber: LL42-GS08; Value: LL42-GS08
R300-R307 R309 = Resistor: Simple generic resistor.; PackageReference: 0603
  R300-R303 R306: Value: 1k 1% 0.1W
  R304: Value: 0R0 1% 0.1W
  R305: Value: DNP
  R307 R309: Value: 100k 1% 0.1W
R308 = Potentiometer: Simple generic potentiometer.; Value: 1k 1% 0.1W
U300 = ADA4817-1: Low Noise, 1 GHz FastFET Op Amps; Manufacturer: Analog Devices; PackageReference: SO-8; Value: ADA4817-1
U301 = LT1712: as U200 on sheet [02] - Discriminators; PackageReference: SSOP-16; Supplier1: Digi-Key; Supplier1PartNumber: LT1712CGN#PBF-ND; Supplier1Link: https://www.digikey.de/product-detail/de/linear-technology-analog-devices/LT1712CGN-PBF/LT1712CGN-PBF-ND/961051; Value: LT1712
U302 = BUF602: as U201 on sheet [02] - Discriminators; PackageReference: SOT-23-5; Value: BUF602

## Sheet [04] - SiPM Bias Voltage Supply.SchDoc
size A4; Address1: III. Physikalisches Institut B; Address2: RWTH Aachen University; Address3: Otto-Blumenthal-Strasse; Address4: 52074 Aachen, GERMANY; DocumentNumber: 5; SheetNumber: 5; SheetTotal: 6
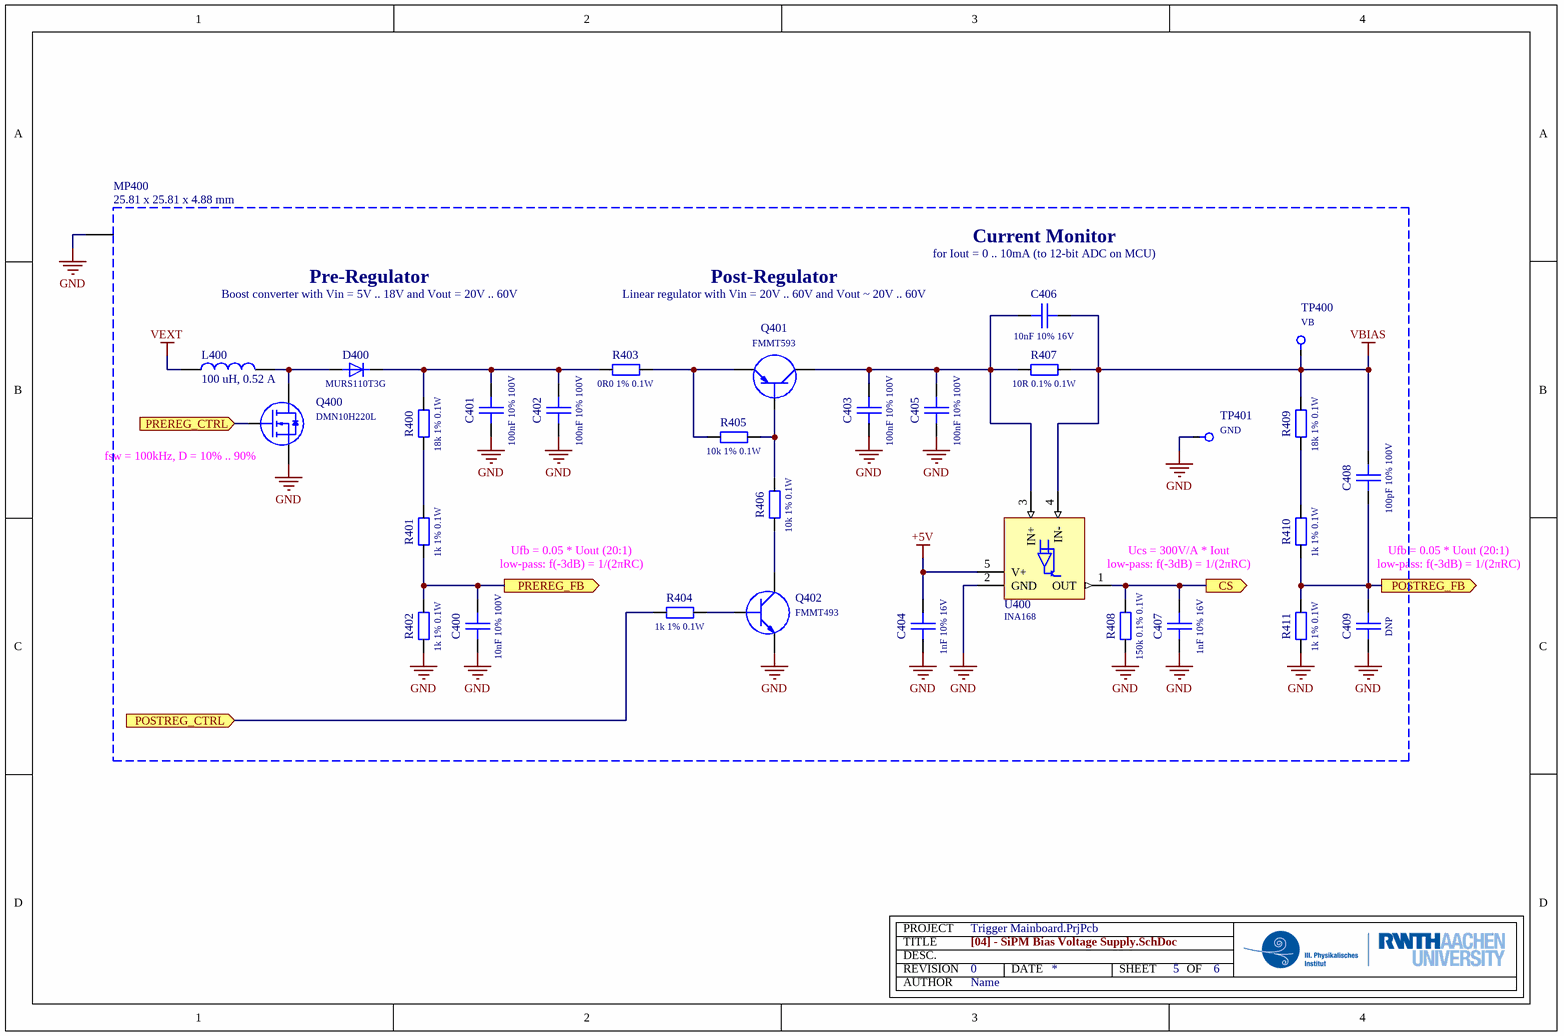
[diagram p5: [04] - SiPM Bias Voltage Supply.SchDoc]

### Parts
C400  10nF 10% 100V  [0603_CAP]
C401  100nF 10% 100V  [0603_CAP]
C402  100nF 10% 100V  [0603_CAP]
C403  100nF 10% 100V  [0603_CAP]
C404  1nF 10% 16V  [0603_CAP]
C405  100nF 10% 100V  [0603_CAP]
C406  10nF 10% 16V  [0603_CAP]
C407  1nF 10% 16V  [0603_CAP]
C408  100pF 10% 100V  [0603_CAP]
C409  DNP  [0603_CAP]
D400  MURS110T3G  [DO-214AA (SMB)]
L400  100 uH, 0.52 A  [WE-SPC_4838]
MP400  25.81 x 25.81 x 4.88 mm  [SMD Frame_36105266S]
Q400  DMN10H220L  [SOT-23 (TO-236)]
Q401  FMMT593  [SOT-23 (TO-236)]
Q402  FMMT493  [SOT-23 (TO-236)]
R400  18k 1% 0.1W  [0603_RES]
R401  1k 1% 0.1W  [0603_RES]
R402  1k 1% 0.1W  [0603_RES]
R403  0R0 1% 0.1W  [0603_RES]
R404  1k 1% 0.1W  [0603_RES]
R405  10k 1% 0.1W  [0603_RES]
R406  10k 1% 0.1W  [0603_RES]
R407  10R 0.1% 0.1W  [0603_RES]
R408  150k 0.1% 0.1W  [0603_RES]
R409  18k 1% 0.1W  [0603_RES]
R410  1k 1% 0.1W  [0603_RES]
R411  1k 1% 0.1W  [0603_RES]
TP400  VB  [Testpoint_5000]
TP401  GND  [Testpoint_5001]
U400  INA168  [SOT-23-5]

### Ports
CS (out), POSTREG_CTRL (in), POSTREG_FB (out), PREREG_CTRL (in), PREREG_FB (out)

### Nets
+5V: C404.2 U400.5(V+)
GND: C400.1 C401.1 C402.1 C403.1 C404.1 C405.1 C407.1 C409.1 MP400.1 Q400.2(S) Q402.2(E) R402.2 R408.2 R411.2 TP401.1 U400.2(GND)
VBIAS: C406.2 C408.2 R407.1 R409.1 TP400.1 U400.4(IN-)
VEXT: L400.1
CSENSE: C407.2 R408.1 U400.1(OUT) ; port CS
POSTREG_CTRL: R404.2 ; port POSTREG_CTRL
POSTREG_FB: C400.2 R401.2 R402.1 ; port PREREG_FB
PREREG_CTRL: Q400.1(G) ; port PREREG_CTRL
PREREG_FB: C408.1 C409.2 R410.2 R411.1 ; port POSTREG_FB
NetC401_2: C401.2 C402.2 D400.1(K) R400.1 R403.2
NetC403_2: C403.2 C405.2 C406.1 Q401.3(C) R407.2 U400.3(IN+)
NetD400_2: D400.2(A) L400.2 Q400.3(D)
NetQ401_1: Q401.1(B) R405.1 R406.1
NetQ401_2: Q401.2(E) R403.1 R405.2
NetQ402_1: Q402.1(B) R404.1
NetQ402_3: Q402.3(C) R406.2
NetR400_2: R400.2 R401.1
NetR409_2: R409.2 R410.1

### Notes on the sheet
- Current Monitor
- Pre-Regulator
- Boost converter with Vin = 5V .. 18V and Vout = 20V .. 60V
- Post-Regulator
- Linear regulator with Vin = 20V .. 60V and Vout ~ 20V .. 60V
- for Iout = 0 .. 10mA (to 12-bit ADC on MCU)
- (near Q400) fsw = 100kHz, D = 10% .. 90%
- Ufb = 0.05 * Uout (20:1)
- low-pass: f(-3dB) = 1/(2πRC)
- Ucs = 300V/A * Iout
- (near U400) low-pass: f(-3dB) = 1/(2πRC)
- (near C409) low-pass: f(-3dB) = 1/(2πRC)
- TITLE
- REVISION
- PROJECT
- AUTHOR
- DESC.
- DATE
- SHEET
- OF

### Library data of the parts
C400-C409 = Capacitor: Simple generic capacitor.; PackageReference: 0603
  C400: Value: 10nF 10% 100V
  C401-C403 C405: Value: 100nF 10% 100V
  C404 C407: Value: 1nF 10% 16V
  C406: Value: 10nF 10% 16V
  C408: Value: 100pF 10% 100V
  C409: Value: DNP
D400 = Diode: Simple generic diode.; Manufacturer: ON Semiconductor; PackageReference: DO-214AA (SMB); PartNumber: MURS110T3G; Value: MURS110T3G
L400 = 74408943101: SMT Shielded Power Inductor WE-SPC, size 4838, 100 uH, 0.52 A; Rated Current: 0.52 A; Inductance: 100 uH; DC Resistance max.: 0.85 Ohm; Self Resonant Frequency: 7.8 MHz; Saturation Current: 0.68 A; ComponentLink1Description: Manufacturer; ComponentLink1URL: http://www.we-online.de; ComponentLink2Description: Datasheet; ComponentLink2URL: https://katalog.we-online.com/pbs/datasheet/74408943101.pdf; Part Number: 74408943101; Published Date: December 2018; Publisher: Wurth Elektronik; Size: 4838; Operating Temperature: -40 to +125 degC; Mounting Technology: SMT; Packaging: Tape and Reel
MP400 = 36105266S: WE-SHC Shielding Cabinet, SMD Frame, 25.81 x 25.81 x 4.88 mm; ComponentLink1Description: Manufacturer; ComponentLink1URL: http://www.we-online.de; ComponentLink2Description: Datasheet; ComponentLink2URL: http://katalog.we-online.de/pbs/datasheet/36105266S.pdf; Part Number: 36105266S; Published Date: Dec. 2017; Publisher: Wurth Elektronik; Length: 25.81 mm; Width: 25.81 mm; Height: 4.88 mm
Q400 = MOSFET_DN: 100V N-CHANNEL ENHANCEMENT MODE MOSFET; Manufacturer: Diodes Incorporated; PackageReference: SOT23; PartNumber: DMN10H220L; Value: DMN10H220L
Q401 = BJT_PNP: Generic Bipolar PNP Transistor; Manufacturer: Diodes Incorporated; PartNumber: FMMT593TA; PackageReference: SOT23; Value: FMMT593
Q402 = BJT_NPN: 100V NPN MEDIUM POWER TRANSISTOR IN SOT23; Manufacturer: Diodes Incorporated; PartNumber: FMMT493TA; PackageReference: SOT23; Value: FMMT493
R400-R411 = Resistor: Simple generic resistor.; PackageReference: 0603
  R400 R409: Value: 18k 1% 0.1W
  R401 R402 R404 R410 R411: Value: 1k 1% 0.1W
  R403: Value: 0R0 1% 0.1W
  R405 R406: Value: 10k 1% 0.1W
  R407: Value: 10R 0.1% 0.1W
  R408: Value: 150k 0.1% 0.1W
TP400 = Testpoint: Red PC Test Point, Miniature Phosphor Bronze, Silver Plating 0.040" (1.02mm) Hole Diameter Mounting Type.; Manufacturer: Keystone Electronics; PartNumber: 5000; PackageReference: Test Point; Value: VB
TP401 = Testpoint: as TP1 on sheet [00] - Top Sheet; PackageReference: Test Point; Value: GND
U400 = INA168: INA1x8 High-Side Measurement Current Shunt Monitor, input 2.7V to 60V.; Manufacturer: Texas Instruments; PartNumber: INA168NA/250; PackageReference: SOT-23-5; Value: INA168

## Nets that join several sheets
+5V: [00] - Top Sheet (J14.4 J15.4 J16.4 J17.4), [05] - Slow Control (7 pins), [04] - SiPM Bias Voltage Supply (C404.2 U400.5)
+5V_A: [05] - Slow Control (C518.2 FB500.2), SH1 (8 pins), SH2 (8 pins), SH3 (8 pins), SH4 (8 pins), D1 (6 pins), [03] - Majority Trigger (10 pins), D2 (6 pins), D3 (6 pins), D4 (6 pins)
-5V_A: [05] - Slow Control (C519.2 FB501.2), SH1 (6 pins), SH2 (6 pins), SH3 (6 pins), SH4 (6 pins), [03] - Majority Trigger (C306.2 C307.2 U300.4)
GND: [00] - Top Sheet (73 pins), [05] - Slow Control (28 pins), SH1 (11 pins), SH2 (11 pins), SH3 (11 pins), SH4 (11 pins), D1 (11 pins), [03] - Majority Trigger (16 pins), [04] - SiPM Bias Voltage Supply (16 pins), D2 (11 pins), D3 (11 pins), D4 (11 pins)
VBIAS: [00] - Top Sheet (J14.6 J15.6 J16.6 J17.6), [04] - SiPM Bias Voltage Supply (6 pins)
VEXT: [05] - Slow Control (C501.2 L500.2 U500.1), [04] - SiPM Bias Voltage Supply (L400.1)
CSENSE: [05] - Slow Control (TP500.1 U501.41), [04] - SiPM Bias Voltage Supply (C407.2 R408.1 U400.1)
DISC0: [00] - Top Sheet (R9.2), D1 (U201A.1), [03] - Majority Trigger (R300.2)
DISC1: [00] - Top Sheet (R10.2), [03] - Majority Trigger (R301.2), D2 (U201B.1)
DISC2: [00] - Top Sheet (R11.2), [03] - Majority Trigger (R302.2), D3 (U201C.1)
DISC3: [00] - Top Sheet (R12.2), [03] - Majority Trigger (R303.2), D4 (U201D.1)
IN0: [00] - Top Sheet (J1.1 R1.1), SH1 (R100A.2)
IN1: [00] - Top Sheet (J2.1 R2.1), SH2 (R100B.2)
IN2: [00] - Top Sheet (J3.1 R3.1), SH3 (R100C.2)
IN3: [00] - Top Sheet (J4.1 R4.1), SH4 (R100D.2)
NetR13_2: [00] - Top Sheet (R13.2), [03] - Majority Trigger (U302.1)
OUT0: [00] - Top Sheet (R5.2), SH1 (U100A.5), D1 (U200A.2)
OUT1: [00] - Top Sheet (R6.2), SH2 (U100B.5), D2 (U200B.2)
OUT2: [00] - Top Sheet (R7.2), SH3 (U100C.5), D3 (U200C.2)
OUT3: [00] - Top Sheet (R8.2), SH4 (U100D.5), D4 (U200D.2)
POSTREG_CTRL: [05] - Slow Control (TP503.1 U501.29), [04] - SiPM Bias Voltage Supply (R404.2)
POSTREG_FB: [05] - Slow Control (TP502.1 U501.10 U501.40), [04] - SiPM Bias Voltage Supply (C400.2 R401.2 R402.1)
PREREG_CTRL: [05] - Slow Control (TP504.1 U501.22), [04] - SiPM Bias Voltage Supply (Q400.1)
PREREG_FB: [05] - Slow Control (TP501.1 U501.42), [04] - SiPM Bias Voltage Supply (C408.1 C409.2 R410.2 R411.1)
T1: [00] - Top Sheet (J14.2), [05] - Slow Control (R500.2)
T2: [00] - Top Sheet (J15.2), [05] - Slow Control (R501.2)
T3: [00] - Top Sheet (J16.2), [05] - Slow Control (R502.2)
T4: [00] - Top Sheet (J17.2), [05] - Slow Control (R503.2)
THRESH0: [00] - Top Sheet (TP1.1), [05] - Slow Control (U503.3), D1 (R200A.2), D2 (R200B.2), D3 (R200C.2), D4 (R200D.2)
THRESH1: [00] - Top Sheet (TP2.1), [05] - Slow Control (U503.14), [03] - Majority Trigger (R306.2)